# Altium schematic sheet 6502_connection.SchDoc
size A4; SheetNumber: 1; SheetTotal: 4
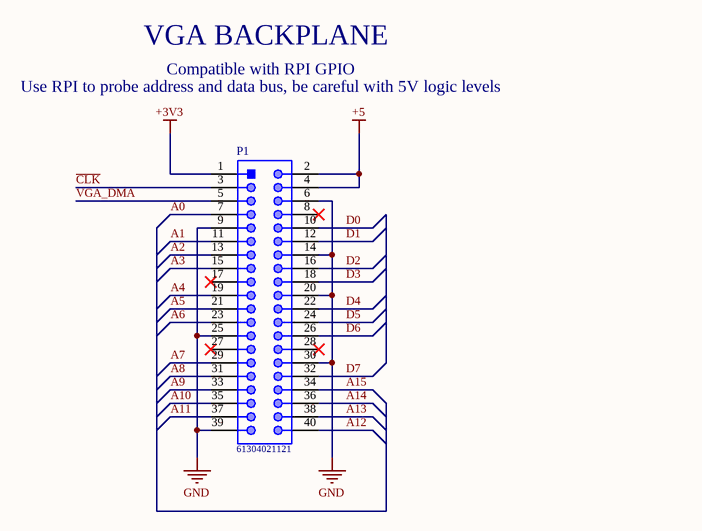
[diagram p0: 6502_connection.SchDoc]

## Parts
P1  61304021121  [61304021121]

## Nets
+3V3: P1.1
+5: P1.2 P1.4
GND: P1.6 P1.9 P1.14 P1.20 P1.25 P1.30 P1.39
A0: P1.7
A1: P1.11
A2: P1.13
A3: P1.15
A4: P1.19
A5: P1.21
A6: P1.23
A7: P1.29
A8: P1.31
A9: P1.33
A10: P1.35
A11: P1.37
A12: P1.40
A13: P1.38
A14: P1.36
A15: P1.34
~{CLK}: P1.3
D0: P1.10
D1: P1.12
D2: P1.16
D3: P1.18
D4: P1.22
D5: P1.24
D6: P1.26
D7: P1.32
VGA_~{DMA}: P1.5

Not connected (* = marked no-connect by the designer): P1 8* 17* 27* 28*

## Notes on the sheet
- VGA BACKPLANE
- Compatible with RPI GPIO
- Use RPI to probe address and data bus, be careful with 5V logic levels

## Library data of the parts
P1 = CMP-1502-01135-1: THT Vertical Pin Header WR-PHD, Pitch 2.54 mm, Dual Row, 40 pins; Manufacturer: Wurth Elektronik; Contact Resistance: 20mOhm; Pitch: 2.54mm; Pin Number: 40; Withstanding Voltage: 500VAC; Gender: Male; Rated Current: 3A; Working Voltage: 250VAC; Operating Temperature: -40to105degC; Manufacturer URL: http://www.we-online.de; Orientation: Vertical; Datasheet URL: https://katalog.we-online.de/em/datasheet/6130xx21121.pdf; Package Reference: 61304021121; Row Number: Dual; Part Number: 61304021121; Packaging: Bag; Mounting Technology: THT; Publisher: WurthElektronik